# Altium project ldc-hw.PrjPcb (part 1 of 2)
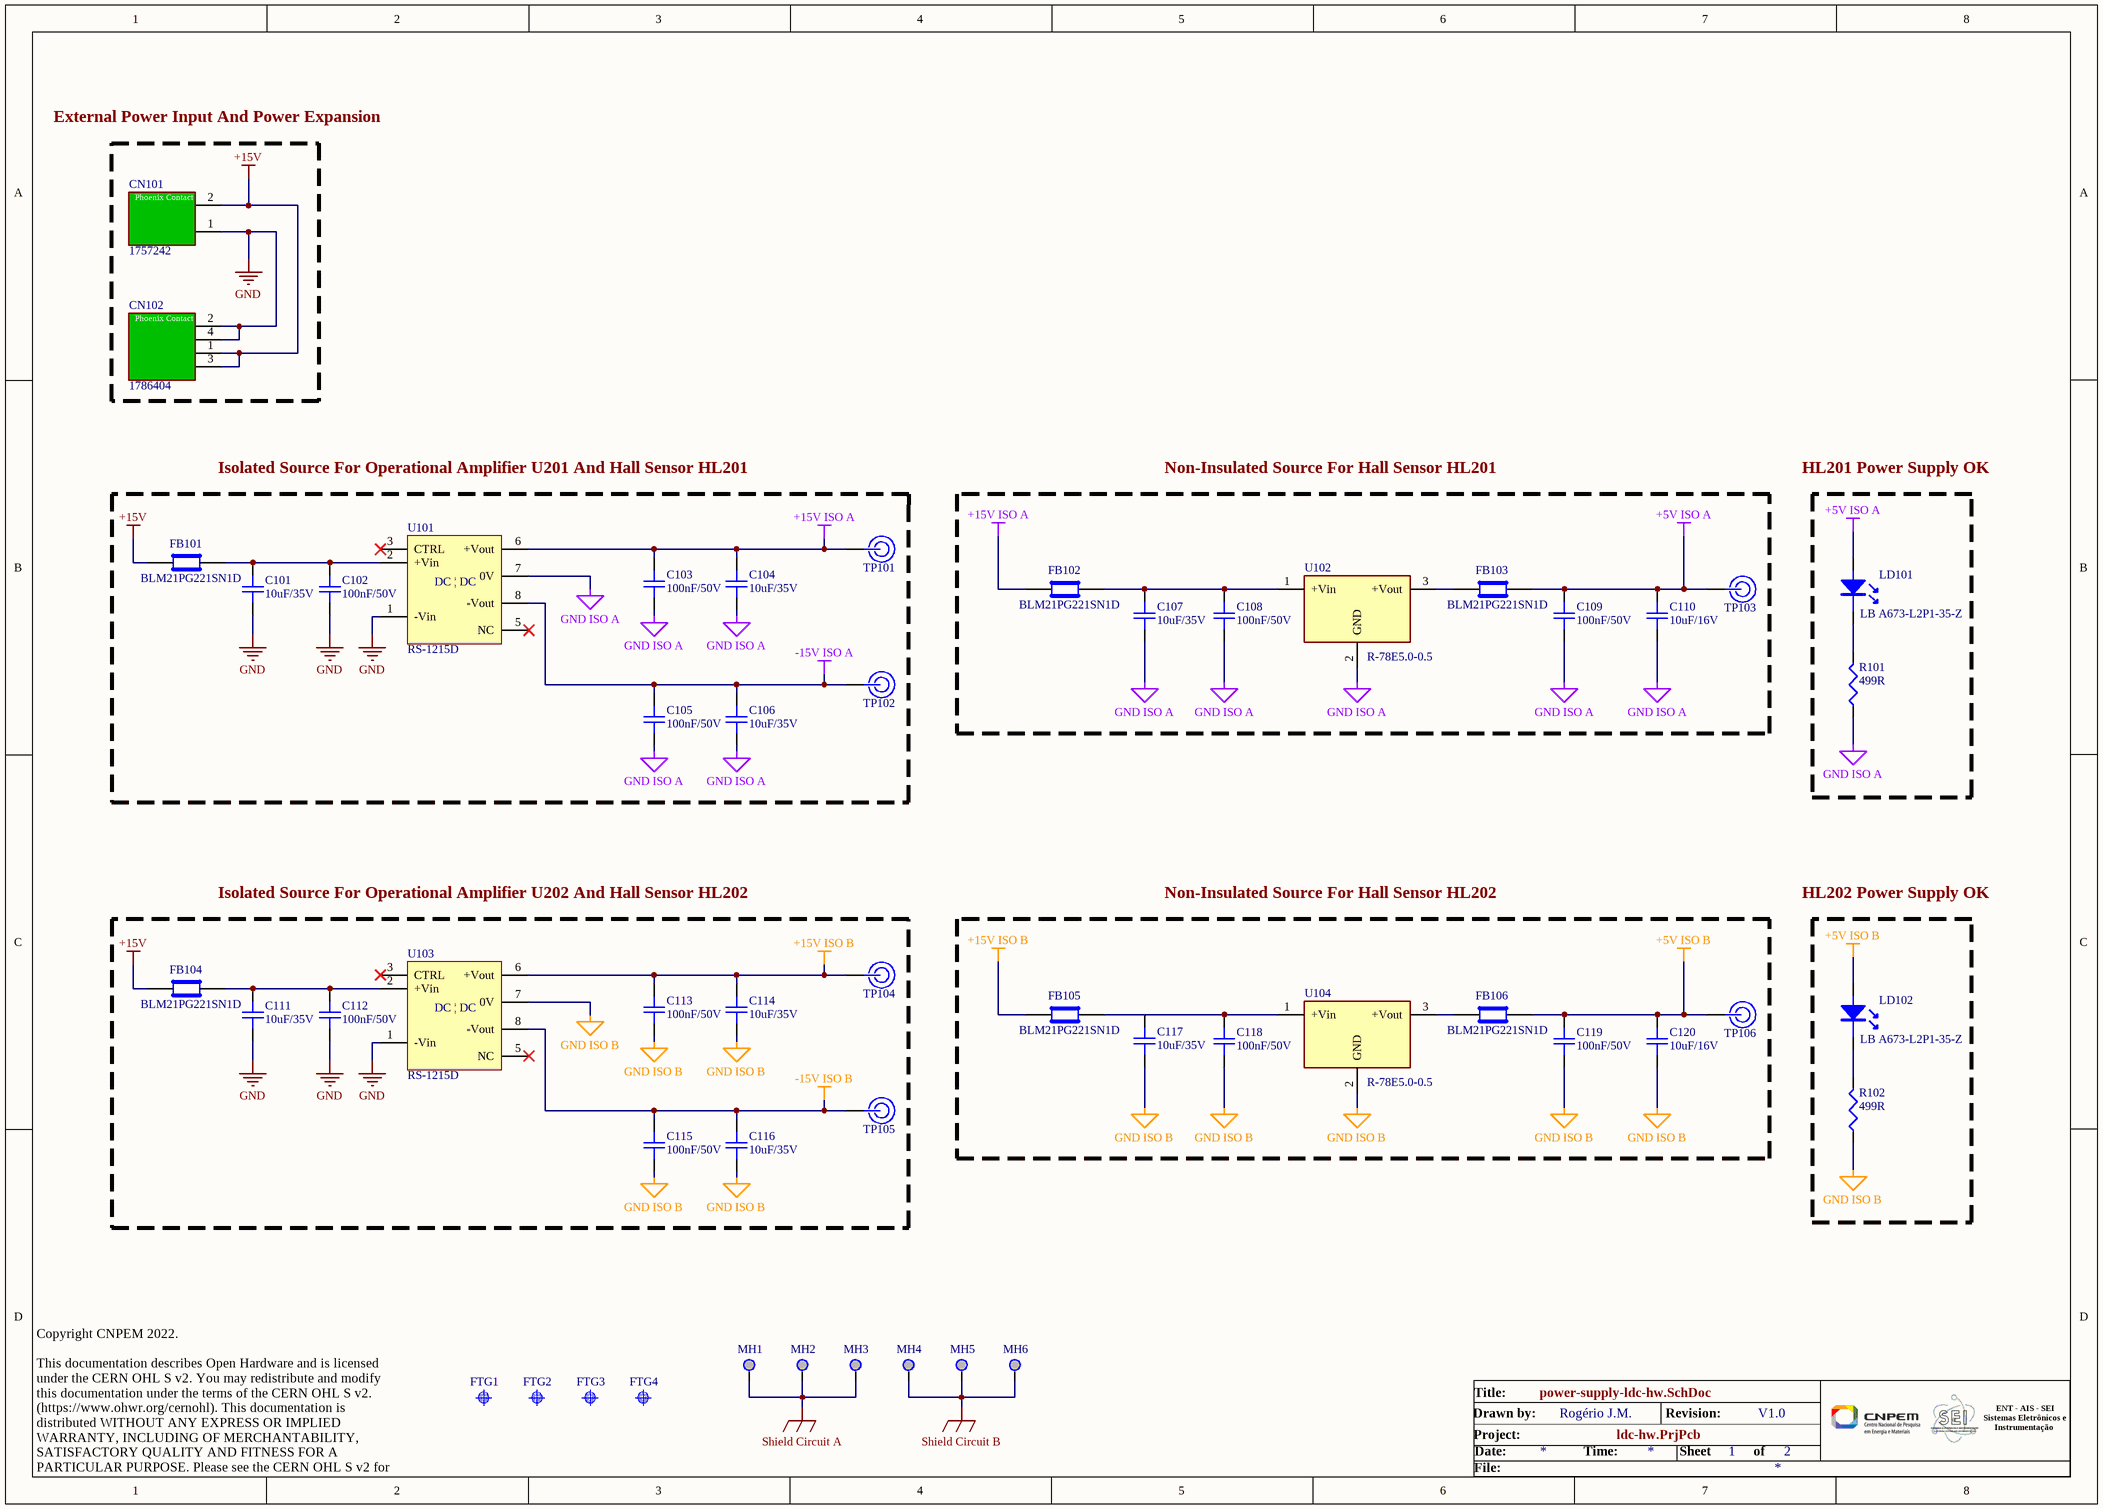
[diagram p0: power-supply-ldc-hw.SchDoc]
2 sheets, 96 parts. Net scope: global (net labels, ports and power ports of the same name join across sheets).
Board file: pcb-ldc-hw.PcbDoc
Sheets:
  power-supply-ldc-hw.SchDoc
  detection-circuit-ldc-hw.SchDoc

## Sheet power-supply-ldc-hw.SchDoc
size A3; DrawnBy: Rogério J.M.; Revision: V1.0; SheetNumber: 1; SheetTotal: 2

### Parts
C101  10uF/35V  [C0805]
C102  100nF/50V  [C0603]
C103  100nF/50V  [C0603]
C104  10uF/35V  [C0805]
C105  100nF/50V  [C0603]
C106  10uF/35V  [C0805]
C107  10uF/35V  [C0805]
C108  100nF/50V  [C0603]
C109  100nF/50V  [C0603]
C110  10uF/16V  [C0603]
C111  10uF/35V  [C0805]
C112  100nF/50V  [C0603]
C113  100nF/50V  [C0603]
C114  10uF/35V  [C0805]
C115  100nF/50V  [C0603]
C116  10uF/35V  [C0805]
C117  10uF/35V  [C0805]
C118  100nF/50V  [C0603]
C119  100nF/50V  [C0603]
C120  10uF/16V  [C0603]
CN101  1757242  [Conector Phoenix Contact 1757242]
CN102  1786404  [Conector Phoenix Contact 1786404]
FB101  BLM21PG221SN1D  [Ferrite_Bead_0805]
FB102  BLM21PG221SN1D  [Ferrite_Bead_0805]
FB103  BLM21PG221SN1D  [Ferrite_Bead_0805]
FB104  BLM21PG221SN1D  [Ferrite_Bead_0805]
FB105  BLM21PG221SN1D  [Ferrite_Bead_0805]
FB106  BLM21PG221SN1D  [Ferrite_Bead_0805]
FTG1  Use only in PCB  [FIDUCIAL_TOP_C100-200]  (value not drawn)
FTG2  Use only in PCB  [FIDUCIAL_TOP_C100-200]  (value not drawn)
FTG3  Use only in PCB  [FIDUCIAL_TOP_C100-200]  (value not drawn)
FTG4  Use only in PCB  [FIDUCIAL_TOP_C100-200]  (value not drawn)
LD101  LB A673-L2P1-35-Z  [2-SMD]
LD102  LB A673-L2P1-35-Z  [2-SMD]
MH1  Use only in PCB  [Mounting Hole]  (value not drawn)
MH2  Use only in PCB  [Mounting Hole]  (value not drawn)
MH3  Use only in PCB  [Mounting Hole]  (value not drawn)
MH4  Use only in PCB  [Mounting Hole]  (value not drawn)
MH5  Use only in PCB  [Mounting Hole]  (value not drawn)
MH6  Use only in PCB  [Mounting Hole]  (value not drawn)
R101  499R  [R0603]
R102  499R  [R0603]
TP101  Test Point White 5012  [TEST POINT]  (value not drawn)
TP102  Test Point White 5012  [TEST POINT]  (value not drawn)
TP103  Test Point White 5012  [TEST POINT]  (value not drawn)
TP104  Test Point White 5012  [TEST POINT]  (value not drawn)
TP105  Test Point White 5012  [TEST POINT]  (value not drawn)
TP106  Test Point White 5012  [TEST POINT]  (value not drawn)
U101  RS-1215D  [SIP7]
U102  R-78E5.0-0.5  [R-78E5.0-0.5]
U103  RS-1215D  [SIP7]
U104  R-78E5.0-0.5  [R-78E5.0-0.5]

### Blocks framed on the sheet
Non-Insulated Source For Hall Sensor HL201: C107-C110 FB102 FB103 TP103 U102
Non-Insulated Source For Hall Sensor HL202: C117-C120 FB105 FB106 TP106 U104

### Nets
+5V ISO A: C109.2 C110.2 FB103.2 LD101.2 TP103.1
+5V ISO B: C119.2 C120.2 FB106.2 LD102.2 TP106.1
+15V: CN101.2 CN102.1 CN102.3 FB101.1 FB104.1
+15V ISO A: C103.2 C104.2 FB102.1 TP101.1 U101.6(+Vout)
+15V ISO B: C113.2 C114.2 FB105.1 TP104.1 U103.6(+Vout)
-15V ISO A: C105.2 C106.2 TP102.1 U101.8(-Vout)
-15V ISO B: C115.2 C116.2 TP105.1 U103.8(-Vout)
GND: C101.1 C102.1 C111.1 C112.1 CN101.1 CN102.2 CN102.4 U101.1(-Vin) U103.1(-Vin)
GND ISO A: C103.1 C104.1 C105.1 C106.1 C107.1 C108.1 C109.1 C110.1 R101.1 U101.7(0V) U102.2(GND)
GND ISO B: C113.1 C114.1 C115.1 C116.1 C117.1 C118.1 C119.1 C120.1 R102.1 U103.7(0V) U104.2(GND)
Shield Circuit A: MH1.1 MH2.1 MH3.1
Shield Circuit B: MH4.1 MH5.1 MH6.1
NetC101_2: C101.2 C102.2 FB101.2 U101.2(+Vin)
NetC107_2: C107.2 C108.2 FB102.2 U102.1(+Vin)
NetC111_2: C111.2 C112.2 FB104.2 U103.2(+Vin)
NetC117_2: C117.2 C118.2 FB105.2 U104.1(+Vin)
NetFB103_1: FB103.1 U102.3(+Vout)
NetFB106_1: FB106.1 U104.3(+Vout)
NetLD101_1: LD101.1 R101.2
NetLD102_1: LD102.1 R102.2

Not connected (* = marked no-connect by the designer): U101 3(CTRL)* 5(NC)*; U103 3(CTRL)* 5(NC)*

### Notes on the sheet
- External Power Input And Power Expansion
- Isolated Source For Operational Amplifier U201 And Hall Sensor HL201
- HL201 Power Supply OK
- Isolated Source For Operational Amplifier U202 And Hall Sensor HL202
- HL202 Power Supply OK
- Title:
- Date:
- Project:
- Drawn by:
- Time:
- Revision:
- Sheet
- of
- ENT - AIS - SEI
  Sistemas Eletrônicos e
  Instrumentação
- Copyright CNPEM 2022.
  This documentation describes Open Hardware and is licensed under the CERN OHL S v2. You may redistribute and modify this documentation under the terms of the CERN OHL S v2. (https://www.ohwr.org/cernohl). This documentation is distributed WITHOUT ANY EXPRESS OR IMPLIED WARRANTY, INCLUDING OF MERCHANTABILITY, SATISFACTORY QUALITY AND FITNESS FOR A PARTICULAR PURPOSE. Please see the CERN OHL S v2 for applicable conditions.
- File:
- (in symbol RS-1215D) DC | DC

### Library data of the parts
C101 C104 C106 C107 C111 C114 C116 C117 = Capacitor 10uF/35V: CAP CER 10UF 35V X5R 0805; Manufacturer: TDK; Manufacturer Part Number: C2012X5R1V106K085AC; Dielectric Material: Ceramic; Tolerance: 10%; Código LNLS: AP105062; Supplier 1: Digi-Key; Stock 1: 56135; Pricing 1: 1=0.73, 10=0.519, 100=0.3416, 500=0.253, 1000=0.2151 (USD); Case/Package: 0805; Weight: 0.000194oz; Case Code (Metric): 2012; Case Code (Imperial): 0805; Min Operating Temperature: -55°C; Max Operating Temperature: 85°C; Package Quantity: 1; Packaging: Tape and Reel; Capacitance: 10uF; Voltage Rating: 35V; Dielectric: X5R; Termination: SMD/SMT; Voltage Rating (DC): 35V; Length: 0.079inch; Height: 0.85mm; Width: 0.049inch; Thickness: 0.039inch; REACH SVHC: No SVHC; Lead Free: Lead Free; ComponentLink1URL: https://datasheet.ciiva.com/14894/tdkmlcccaprange-14894527.pdf; ComponentLink1Description: https://datasheet.ciiva.com/14894/tdkmlcccaprange-14894527.pdf; Supplier Part Number 1: 445-14417-1-ND
C102 C103 C105 C108 C109 C112 C113 C115 C118 C119 = Capacitor 100nF/50V: CAP CER 0.1UF 50V X7R 0603; Manufacturer: TDK; Manufacturer Part Number: C1608X7R1H104K080AA; Dielectric Material: Ceramic; Capacitance: 100nF; Tolerance: 10%; Código LNLS: AP107349; Supplier 1: Digi-Key; RoHS: Yes; Category: Ceramic Capacitors; Stock 1: 4478231; Pricing 1: 1=0,11000, 10=0,08000, 50=0,04520, 100=0,03750, 500=0,02630, 1000=0,02178 (USD); Mount: Surface Mount; Case/Package: 0603; Number of Pins: 2; Case Code (Imperial): 0603; Case Code (Metric): 1608; Weight: 7.1E-05oz; Min Operating Temperature: -55°C; Max Operating Temperature: 125°C; Dielectric: X7R; Voltage Rating: 50V; Packaging: Tape and Reel; Package Quantity: 1; Termination: SMD/SMT; Voltage: 50V; Construction: Flat; Voltage Rating (DC): 50V; Resistor Type: Ceramic; Series: C; Length: 1.6mm; Width: 0.031inch; Height: 0.8mm; Depth: 0.8mm; Thickness: 0.037inch; Radiation Hardening: No; REACH SVHC: No SVHC; RoHS Compliant: Yes; Lead Free: Lead Free; ComponentLink1URL: https://datasheet.ciiva.com/14498/1756137-14498091.pdf?src-supplier=Farnell; ComponentLink1Description: https://datasheet.ciiva.com/14498/1756137-14498091.pdf?src-supplier=Farnell; ComponentLink2URL: https://datasheet.ciiva.com/11788/0900766b80c1bb00-11788073.pdf?src-supplier=RSComponents; ComponentLink2Description: https://datasheet.ciiva.com/11788/0900766b80c1bb00-11788073.pdf?src-supplier=RSComponents; ComponentLink3URL: https://datasheet.ciiva.com/6293/tdkmlcccaprange-6293190.pdf?src-supplier=Digi-Key; ComponentLink3Description: https://datasheet.ciiva.com/6293/tdkmlcccaprange-6293190.pdf?src-supplier=Digi-Key; ComponentLink4URL: https://datasheet.ciiva.com/6293/tdkmlcccaprange-6293193.pdf?src-supplier=Digi-Key; ComponentLink4Description: https://datasheet.ciiva.com/6293/tdkmlcccaprange-6293193.pdf?src-supplier=Digi-Key; ComponentLink5URL: https://datasheet.ciiva.com/6293/tdkmlcccaprange-6293194.pdf?src-supplier=Digi-Key; ComponentLink5Description: https://datasheet.ciiva.com/6293/tdkmlcccaprange-6293194.pdf?src-supplier=Digi-Key; ComponentLink6URL: https://datasheet.ciiva.com/22749/1744655-22749597.pdf?src-supplier=Element14; ComponentLink6Description: https://datasheet.ciiva.com/22749/1744655-22749597.pdf?src-supplier=Element14; ComponentLink7URL: https://datasheet.ciiva.com/17487/e412-c-17487370.pdf?src-supplier=Avnet+Europe; ComponentLink7Description: https://datasheet.ciiva.com/17487/e412-c-17487370.pdf?src-supplier=Avnet+Europe; Supplier Part Number 1: 445-1314-1-ND
C110 C120 = Capacitor 10uF/16V: CAP CER 10UF 16V X5R 0603; Manufacturer: TDK; Manufacturer Part Number: C1608X5R1C106M080AB; Dielectric Material: Ceramic; Tolerance: 20%; Código LNLS: AP105460; Supplier 1: Digi-Key; Stock 1: 85682; Pricing 1: 1=0.75, 10=0.553, 100=0.3795, 500=0.3004, 1000=0.253 (USD); Case/Package: 0603; Weight: 7.1E-05oz; Case Code (Metric): 1608; Case Code (Imperial): 0603; Min Operating Temperature: -55°C; Max Operating Temperature: 85°C; Package Quantity: 4000; Capacitance: 10uF; Voltage Rating: 16V; Packaging: Tape and Reel; Voltage Rating (DC): 16V; Dielectric: X5R; Termination: SMD/SMT; Composition: Ceramic; Length: 1.6mm; Height: 0.8mm; Width: 0.031inch; Thickness: 0.039inch; Depth: 0.8mm; Radiation Hardening: No; REACH SVHC: No SVHC; Lead Free: Lead Free; ComponentLink1URL: https://datasheet.ciiva.com/26946/getdatasheetpartid-727879-26946512.pdf; ComponentLink1Description: https://datasheet.ciiva.com/26946/getdatasheetpartid-727879-26946512.pdf; ComponentLink2URL: https://datasheet.ciiva.com/24216/mlcc-commercial-general-en-24216005.pdf; ComponentLink2Description: https://datasheet.ciiva.com/24216/mlcc-commercial-general-en-24216005.pdf; ComponentLink3URL: https://datasheet.ciiva.com/16449/mlcc-commercial-general-en-16449581.pdf; ComponentLink3Description: https://datasheet.ciiva.com/16449/mlcc-commercial-general-en-16449581.pdf; Supplier Part Number 1: 445-9065-1-ND
CN101 = Conector Phoenix Contact 1757242: TERM BLOCK HDR 2POS 90DEG 5.08MM; Max Current Rating: 12A; Number of Poles: 2; Voltage Rating: 250V; Number of Levels: 1; Current: 15A; Voltage: 300V; Gender: Male; Voltage Rating (DC): 320V; Approvals: UL,CSA,VDE,EN; Código LNLS: MT106521; Supplier 1: Digi-Key; Manufacturer: Phoenix Contact; Manufacturer Part Number: 1757242; Stock 1: 5888; Pricing 1: 1=0.59, 10=0.564, 50=0.539, 100=0.5243, 250=0.49, 500=0.4508, 1000=0.4165, 2500=0.3969, 5000=0.3724 (USD); Mount: Through Hole; Weight: 5.396916oz; Contact Plating: Tin; Colour: Green,Grey; Housing Colour: Green; Housing Material: Polyamide; Current Rating: 12A; Package Quantity: 50; Packaging: Bulk; Number of Positions: 2; Termination: Solder; Number of Positions Per Level: 2; Number of Contacts: 2; Number of Rows: 1; Orientation: Right Angle; Length: 12.16mm; Pitch: 5.08mm; Width: 5.08mm; Depth: 12mm; REACH SVHC: No SVHC; Lead Free: Lead Free; Flammability Rating: UL94 V-0; ComponentLink1URL: https://datasheet.ciiva.com/15197/getdatasheetpartid-176350-15197328.pdf; ComponentLink1Description: https://datasheet.ciiva.com/15197/getdatasheetpartid-176350-15197328.pdf; ComponentLink2URL: https://datasheet.ciiva.com/16096/1757242-16096402.pdf; ComponentLink2Description: https://datasheet.ciiva.com/16096/1757242-16096402.pdf; ComponentLink3URL: https://datasheet.ciiva.com/7630/100955-7630839.pdf; ComponentLink3Description: https://datasheet.ciiva.com/7630/100955-7630839.pdf; ComponentLink4URL: https://datasheet.ciiva.com/795/1757242-795407.pdf; ComponentLink4Description: https://datasheet.ciiva.com/795/1757242-795407.pdf; ComponentLink5URL: https://datasheet.ciiva.com/33105/1757242-33105868.pdf; ComponentLink5Description: https://datasheet.ciiva.com/33105/1757242-33105868.pdf; ComponentLink6URL: https://datasheet.ciiva.com/29210/569017-da-01-en-grundgehaeuse-1757242-250-st-29210285.pdf; ComponentLink6Description: https://datasheet.ciiva.com/29210/569017-da-01-en-grundgehaeuse-1757242-250-st-29210285.pdf; Supplier Part Number 1: 277-1106-ND
CN102 = Conector Phoenix Contact 1786404: PLUG TERM BLOCK HDR 2POS 90DEG 5.08MM; Voltage Rating: 320V; Current Rating: 12A; Number of Poles: 2; Number of Levels: 1; Current: 10A; Voltage: 300V; Connector Type: Socket; Approvals: UL,CSA,VDE,CB,GOST; Código LNLS: MC113986; Supplier 1: Digi-Key; Manufacturer: Phoenix Contact; Manufacturer Part Number: 1786404; RoHS: Yes; Category: Terminal Blocks; Stock 1: 2375; Pricing 1: 1=2,32000, 10=2,25800, 50=2,11000, 100=1,94120, 250=1,79348, 500=1,70910, 1000=1,62470 (USD); Mount: Through Hole; Color: Green; Contact Plating: Tin; Contact Material: Tin; Weight: 5.78493oz; Housing Color: Green; Housing Material: Polyamide; Packaging: Bulk; Series: IC; Package Quantity: 50; Termination: Solder; Number of Rows: 1; Number of Positions Per Level: 2; Max Current Rating: 12A; Number of Positions: 2; Number of Contacts: 2; Orientation: Right Angle; Type: Integrated Circuit (IC); Length: 12.16mm; Width: 19mm; Height: 13.7mm; Pitch: 5.08mm; Depth: 19mm; RoHS Compliant: Yes; Lead Free: Lead Free; Flammability Rating: UL94 V-0; ComponentLink1URL: https://datasheet.ciiva.com/16096/1786404-16096800.pdf?src-supplier=Onlinecomponents.com; ComponentLink1Description: https://datasheet.ciiva.com/16096/1786404-16096800.pdf?src-supplier=Onlinecomponents.com; ComponentLink2URL: https://datasheet.ciiva.com/6747/1786404-6747449.pdf?src-supplier=Digi-Key; ComponentLink2Description: https://datasheet.ciiva.com/6747/1786404-6747449.pdf?src-supplier=Digi-Key; ComponentLink3URL: https://datasheet.ciiva.com/11748/0900766b800b6097-11748807.pdf?src-supplier=RSComponents; ComponentLink3Description: https://datasheet.ciiva.com/11748/0900766b800b6097-11748807.pdf?src-supplier=RSComponents; ComponentLink4URL: https://datasheet.ciiva.com/29209/567660-da-01-de-grundgehaeuse-1786404-50-st-29209089.pdf?src-supplier=Conrad; ComponentLink4Description: https://datasheet.ciiva.com/29209/567660-da-01-de-grundgehaeuse-1786404-50-st-29209089.pdf?src-supplier=Conrad; Supplier Part Number 1: 277-5986-ND
FB101-FB106 = BLM21PG221SN1D: FERRITE BEAD 220 OHM 0805 1LN; Manufacturer: Murata; Material: Steel,Ferrite; Impedance: 220R; Tolerance: 25%; Max Current Rating: 2A; Number of Lines: 1; DC Resistance (DCR): 45mR; Test Frequency: 100MHz; Shielding: Unshielded; Código LNLS: AP105046; Manufacturer Part Number: BLM21PG221SN1D; Stock 1: 879222; Pricing 1: 1=0.1, 10=0.081, 25=0.0732, 50=0.0538, 100=0.0464, 250=0.0366, 500=0.0309, 1000=0.0261 (USD); Case/Package: 0805; Number of Pins: 2; Core Material: Ferrite; Case Code (Metric): 2012; Case Code (Imperial): 0805; Contact Plating: Tin,Matte; Min Operating Temperature: -55°C; Max Operating Temperature: 125°C; Package Quantity: 1; Packaging: Tape and Reel; Current Rating: 2A; Max DC Current: 2A; Termination: SMD/SMT; DC Current: 2A; Military Standard: Not; Frequency: 100MHz; Number of Circuits: 1; Current: 2A; Length: 2mm; Height: 0.85mm; Width: 1.25mm; Depth: 1.25mm; Radiation Hardening: No; REACH SVHC: No SVHC; Lead Free: Lead Free; ComponentLink1URL: https://datasheet.ciiva.com/1012/l0110s0100blm21p-1012288.pdf; ComponentLink1Description: https://datasheet.ciiva.com/1012/l0110s0100blm21p-1012288.pdf; ComponentLink2URL: https://datasheet.ciiva.com/11799/0900766b81275e31-11799232.pdf; ComponentLink2Description: https://datasheet.ciiva.com/11799/0900766b81275e31-11799232.pdf; ComponentLink3URL: https://datasheet.ciiva.com/1012/l0110s0100blm21p-1012289.pdf; ComponentLink3Description: https://datasheet.ciiva.com/1012/l0110s0100blm21p-1012289.pdf; ComponentLink4URL: https://datasheet.ciiva.com/14122/anblm21p-data-e-14122214.pdf; ComponentLink4Description: https://datasheet.ciiva.com/14122/anblm21p-data-e-14122214.pdf; ComponentLink5URL: https://datasheet.ciiva.com/3081/l0110s0100blm21p-3081655.pdf; ComponentLink5Description: https://datasheet.ciiva.com/3081/l0110s0100blm21p-3081655.pdf; ComponentLink6URL: https://datasheet.ciiva.com/3081/l0110s0100blm21p-3081656.pdf; ComponentLink6Description: https://datasheet.ciiva.com/3081/l0110s0100blm21p-3081656.pdf; ComponentLink7URL: https://datasheet.ciiva.com/16215/l0110s0100blm21p-16215194.pdf; ComponentLink7Description: https://datasheet.ciiva.com/16215/l0110s0100blm21p-16215194.pdf; ComponentLink8URL: https://datasheet.ciiva.com/8021/1756152-8021596.pdf; ComponentLink8Description: https://datasheet.ciiva.com/8021/1756152-8021596.pdf; ComponentLink9URL: https://datasheet.ciiva.com/30514/1845321-30514028.pdf; ComponentLink9Description: https://datasheet.ciiva.com/30514/1845321-30514028.pdf; ComponentLink10URL: https://datasheet.ciiva.com/8021/1756152-8021598.pdf; ComponentLink10Description: https://datasheet.ciiva.com/8021/1756152-8021598.pdf; ComponentLink11URL: https://datasheet.ciiva.com/1012/l0110s0100blm21p-1012287.pdf; ComponentLink11Description: https://datasheet.ciiva.com/1012/l0110s0100blm21p-1012287.pdf; ComponentLink12URL: https://datasheet.ciiva.com/29348/442529-da-01-en-chip-drossel-0805-220r-2000ma-2-0x1-25mm-29348007.pdf; ComponentLink12Description: https://datasheet.ciiva.com/29348/442529-da-01-en-chip-drossel-0805-220r-2000ma-2-0x1-25mm-29348007.pdf; Supplier 1: RSComponents; Supplier Part Number 1: 7241532P
FTG1-FTG4 = Fiducial Target
LD101 LD102 = LB A673-L2P1-35-Z: LED BLUE CLEAR 2SMD R/A; Manufacturer: OSRAM Opto Semiconductors Inc.; Lens Color: Colorless; Millicandela Rating: 35mcd; Lens Style/Size: Round with Flat Top, 2.40mm; Voltage - Forward (Vf) (Typ): 3.1V; Current - Test: 10mA; Viewing Angle: 120°; Wavelength - Dominant: 471nm; Wavelength - Peak: 466nm; Código LNLS: AP112060; Supplier 1: Digi-Key; Manufacturer Part Number: LB A673-L2P1-35-Z; RoHS: RoHS Compliant; Category: Optoelectronics; Stock 1: 7315; Pricing 1: 1=0.7, 10=0.548, 25=0.454, 100=0.3914, 250=0.3444, 500=0.29744, 1000=0.26091 (USD); Packaging: Cut Tape (CT); Part Status: Active; Color: Blue; Lens Transparency: Clear; Mounting Type: Surface Mount, Right Angle; Features: -; Package / Case: 2-SMD, Boomerang; Supplier Device Package: SMD; Size / Dimension: 4.00mm L x 3.60mm W; Height (Max): 4.20mm; ComponentLink1URL: http://www.osram-os.com/Graphics/XPic4/00180889_0.pdf; ComponentLink1Description: http://www.osram-os.com/Graphics/XPic4/00180889_0.pdf; Supplier Part Number 1: 475-1379-1-ND
MH1-MH6 = Mounting Hole
R101 R102 = Resistor 499R: RES SMD 499R OHM 1% 1/10W 0603; Manufacturer: Yageo; Manufacturer Part Number: RC0603FR-07499RL; Temperature Coefficient: 100ppm/°C; Power Rating: 100mW; Voltage Rating: 50V; Código LNLS: MC115895; Supplier 1: Digi-Key; RoHS: Yes; Category: Chip SMD Resistors; Stock 1: 94542; Pricing 1: 1=0,10000, 10=0,02400, 100=0,00970, 1000=0,00436, 2500=0,00378 (USD); Mount: Surface Mount; Case/Package: 0603; Contact Plating: Tin,Matte; Case Code (Metric): 1608; Case Code (Imperial): 0603; Size Code: 0603; Min Operating Temperature: -55°C; Max Operating Temperature: 155°C; Resistance: 499R; Tolerance: 1%; Resistor Type: Thick Film; Package Quantity: 1; Packaging: Tape and Reel; Number of Terminations: 2; Termination: SMD/SMT; Max Power Dissipation: 100mW; Voltage Rating (DC): 50V; Features: Moisture Resistant; Series: RC; Construction: Rectangular; Technology: THICK FILM; Length: 1.6mm; Width: 0.031inch; Height: 0.45mm; Depth: 0.8mm; Radiation Hardening: No; Military Standard: Not; Lead Free: Lead Free; RoHS Compliant: Yes; ComponentLink1URL: https://datasheet.ciiva.com/11808/0900766b80f96399-11808558.pdf?src-supplier=RSComponents; ComponentLink1Description: https://datasheet.ciiva.com/11808/0900766b80f96399-11808558.pdf?src-supplier=RSComponents; ComponentLink2URL: https://datasheet.ciiva.com/2453/pyu-r-int-thick-7-2453955.pdf?src-supplier=Digi-Key; ComponentLink2Description: https://datasheet.ciiva.com/2453/pyu-r-int-thick-7-2453955.pdf?src-supplier=Digi-Key; ComponentLink3URL: https://datasheet.ciiva.com/2453/pyu-r-int-thick-7-2453956.pdf?src-supplier=Digi-Key; ComponentLink3Description: https://datasheet.ciiva.com/2453/pyu-r-int-thick-7-2453956.pdf?src-supplier=Digi-Key; ComponentLink4URL: https://datasheet.ciiva.com/2453/pyu-r-int-thick-7-2453957.pdf?src-supplier=Digi-Key; ComponentLink4Description: https://datasheet.ciiva.com/2453/pyu-r-int-thick-7-2453957.pdf?src-supplier=Digi-Key; ComponentLink5URL: https://datasheet.ciiva.com/12558/rc0603-272842-12558391.pdf?src-supplier=Mouser; ComponentLink5Description: https://datasheet.ciiva.com/12558/rc0603-272842-12558391.pdf?src-supplier=Mouser; ComponentLink6URL: https://datasheet.ciiva.com/8885/pyu-rc0603-51-rohs-l-4-8885483.pdf?src-supplier=Avnet; ComponentLink6Description: https://datasheet.ciiva.com/8885/pyu-rc0603-51-rohs-l-4-8885483.pdf?src-supplier=Avnet; ComponentLink7URL: https://datasheet.ciiva.com/16874/pyu-rc0603-51-rohs-l-4-16874517.pdf?src-supplier=Avnet+Europe; ComponentLink7Description: https://datasheet.ciiva.com/16874/pyu-rc0603-51-rohs-l-4-16874517.pdf?src-supplier=Avnet+Europe; Supplier Part Number 1: 311-499HRCT-ND
TP101-TP106 = TEST POINT 5012: Manufacturer: Keystone Electronics; Manufacturer Part Number: 5012; Plating: Silver; Material - Insulation: Nylon 46, UL 94V-0; Material - Body: Phosphor Bronze; Código LNLS: MT105229; Supplier 1: Digi-Key; RoHS: RoHS Compliant; Category: Test and Measurement; Stock 1: 132720; Pricing 1: 1=0.37, 10=0.316, 50=0.2298, 100=0.2209, 250=0.19832, 500=0.18932, 1000=0.1616, 2500=0.14424, 5000=0.13523 (USD); Packaging: Bulk; Part Status: Active; Type: PC Test Point, Multipurpose; Mounting Type: 0.063" (1.60mm) Hole Diameter; Color: White; Size / Dimension: 0.125" Dia x 0.320" L (3.18mm x 8.13mm); Height: -; ComponentLink1URL: http://www.keyelco.com/product-pdf.cfm?p=1321; ComponentLink1Description: http://www.keyelco.com/product-pdf.cfm?p=1321; Supplier Part Number 1: 36-5012-ND
U101 U103 = RS-1215D: Module DC-DC 2-OUT 15V/-15V 0.067A/-0.067A 2W 7-Pin SIP Tube; Manufacturer: Recom; Number of Outputs: 2; Nominal Input Voltage: 12V; Voltage - Output 1: 15V; Isolation Voltage: 1kV; Efficiency: 80%; Min Input Voltage: 9V; Max Input Voltage: 18V; Max Output Current: 67mA; Voltage - Output 2: -15V; Isolation: Isolated; Código LNLS: MC115902; Supplier 1: Digi-Key; Manufacturer Part Number: RS-1215D; RoHS: Yes; Category: Board Mount Modules; Stock 1: 312; Pricing 1: 1=18,77000, 5=18,62400, 10=18,48000, 25=18,19120, 50=17,32500, 100=15,88120, 250=15,59248, 440=15,40000 (USD); Mount: Through Hole,PCB; Case/Package: SIP; Number of Pins: 7; Weight: 4.7g; Min Operating Temperature: -40°C; Max Operating Temperature: 85°C; Packaging: Rail/Tube; Output Power: 2W; Max Output Voltage: 15V; Package Quantity: 22; Min Input Voltage (DC): 9V; Max Input Voltage (DC): 18V; Current - Output 1: 67mA; Max Output Power: 2W; Current - Output 2: 67mA; Max Power Dissipation: 2W; Features: SCP; Series: RS; Output Voltage: 15V; Output Current: 67mA; Length: 21.8mm; Width: 9.2mm; Height: 11.1mm; Depth: 9.2mm; Lead Free: Lead Free; RoHS Compliant: Yes; REACH SVHC: No SVHC; ComponentLink1URL: https://datasheet.ciiva.com/11837/0900766b80518158-11837172.pdf?src-supplier=RSComponents; ComponentLink1Description: https://datasheet.ciiva.com/11837/0900766b80518158-11837172.pdf?src-supplier=RSComponents; ComponentLink2URL: https://datasheet.ciiva.com/29336/154838-da-01-en-dc-dc-wandler-29336507.pdf?src-supplier=Conrad; ComponentLink2Description: https://datasheet.ciiva.com/29336/154838-da-01-en-dc-dc-wandler-29336507.pdf?src-supplier=Conrad; ComponentLink3URL: https://datasheet.ciiva.com/2179/rs-s-d-z-2179956.pdf?src-supplier=Digi-Key; ComponentLink3Description: https://datasheet.ciiva.com/2179/rs-s-d-z-2179956.pdf?src-supplier=Digi-Key; ComponentLink4URL: https://datasheet.ciiva.com/3356/ryrs-3356389.pdf?src-supplier=Distrelec; ComponentLink4Description: https://datasheet.ciiva.com/3356/ryrs-3356389.pdf?src-supplier=Distrelec; ComponentLink5URL: https://datasheet.ciiva.com/46404/1842335-46404424.pdf?src-supplier=Element14; ComponentLink5Description: https://datasheet.ciiva.com/46404/1842335-46404424.pdf?src-supplier=Element14; Supplier Part Number 1: 945-1547-5-ND
U102 U104 = R-78E5.0-0.5: CONV DC/DC 5V 500MA OUT THRU; Manufacturer: Recom; Power Rating: 2.5W; Min Input Voltage (DC): 7V; Max Input Voltage (DC): 28V; Number of Outputs: 1; Efficiency: 92%; Isolation: Non-Isolated; Max Power Dissipation: 3W; Código LNLS: AP105018; Supplier 1: Digi-Key; Manufacturer Part Number: R-78E5.0-0.5; Stock 1: 10893; Pricing 1: 1=2.7, 5=2.656, 10=2.618, 25=2.5412, 50=2.464, 100=2.387, 250=2.31, 500=2.156 (USD); Mount: Through Hole,PCB; Case/Package: SIP; Number of Pins: 3; Weight: 2g; Min Operating Temperature: -40°C; Max Operating Temperature: 85°C; Nominal Output Voltage: 5V; Max Output Current: 500mA; Output Current: 500mA; Output Voltage: 5V; Output Power: 2.5W; Packaging: Rail/Tube; Min Input Voltage: 7V; Package Quantity: 42; Voltage - Output 1: 5V; Current - Output 1: 500mA; Max Input Voltage: 28V; Max Output Power: 2.5W; Max Output Voltage: 5V; Length: 11.6mm; Height: 10.4mm; Width: 8.5mm; Depth: 11.6mm; REACH SVHC: No SVHC; Lead Free: Lead Free; ComponentLink1URL: https://datasheet.ciiva.com/7618/1518729-7618512.pdf; ComponentLink1Description: https://datasheet.ciiva.com/7618/1518729-7618512.pdf; ComponentLink2URL: https://datasheet.ciiva.com/16366/r-78exx-0-5-16366357.pdf; ComponentLink2Description: https://datasheet.ciiva.com/16366/r-78exx-0-5-16366357.pdf; ComponentLink3URL: https://datasheet.ciiva.com/14155/r78xx-05-eng-datasheet-14155703.pdf; ComponentLink3Description: https://datasheet.ciiva.com/14155/r78xx-05-eng-datasheet-14155703.pdf; ComponentLink4URL: https://datasheet.ciiva.com/25627/0900766b810a2db7-25627246.pdf; ComponentLink4Description: https://datasheet.ciiva.com/25627/0900766b810a2db7-25627246.pdf; ComponentLink5URL: https://datasheet.ciiva.com/2168/r-78exx-0-5-02-2168671.pdf; ComponentLink5Description: https://datasheet.ciiva.com/2168/r-78exx-0-5-02-2168671.pdf; Supplier Part Number 1: 945-1648-5-ND